# Altium schematic sheet lab2_lyahovskij_buck.SchDoc: =title_line_1 + title_line_2
size 594 x 420 mm; SheetNumber: n
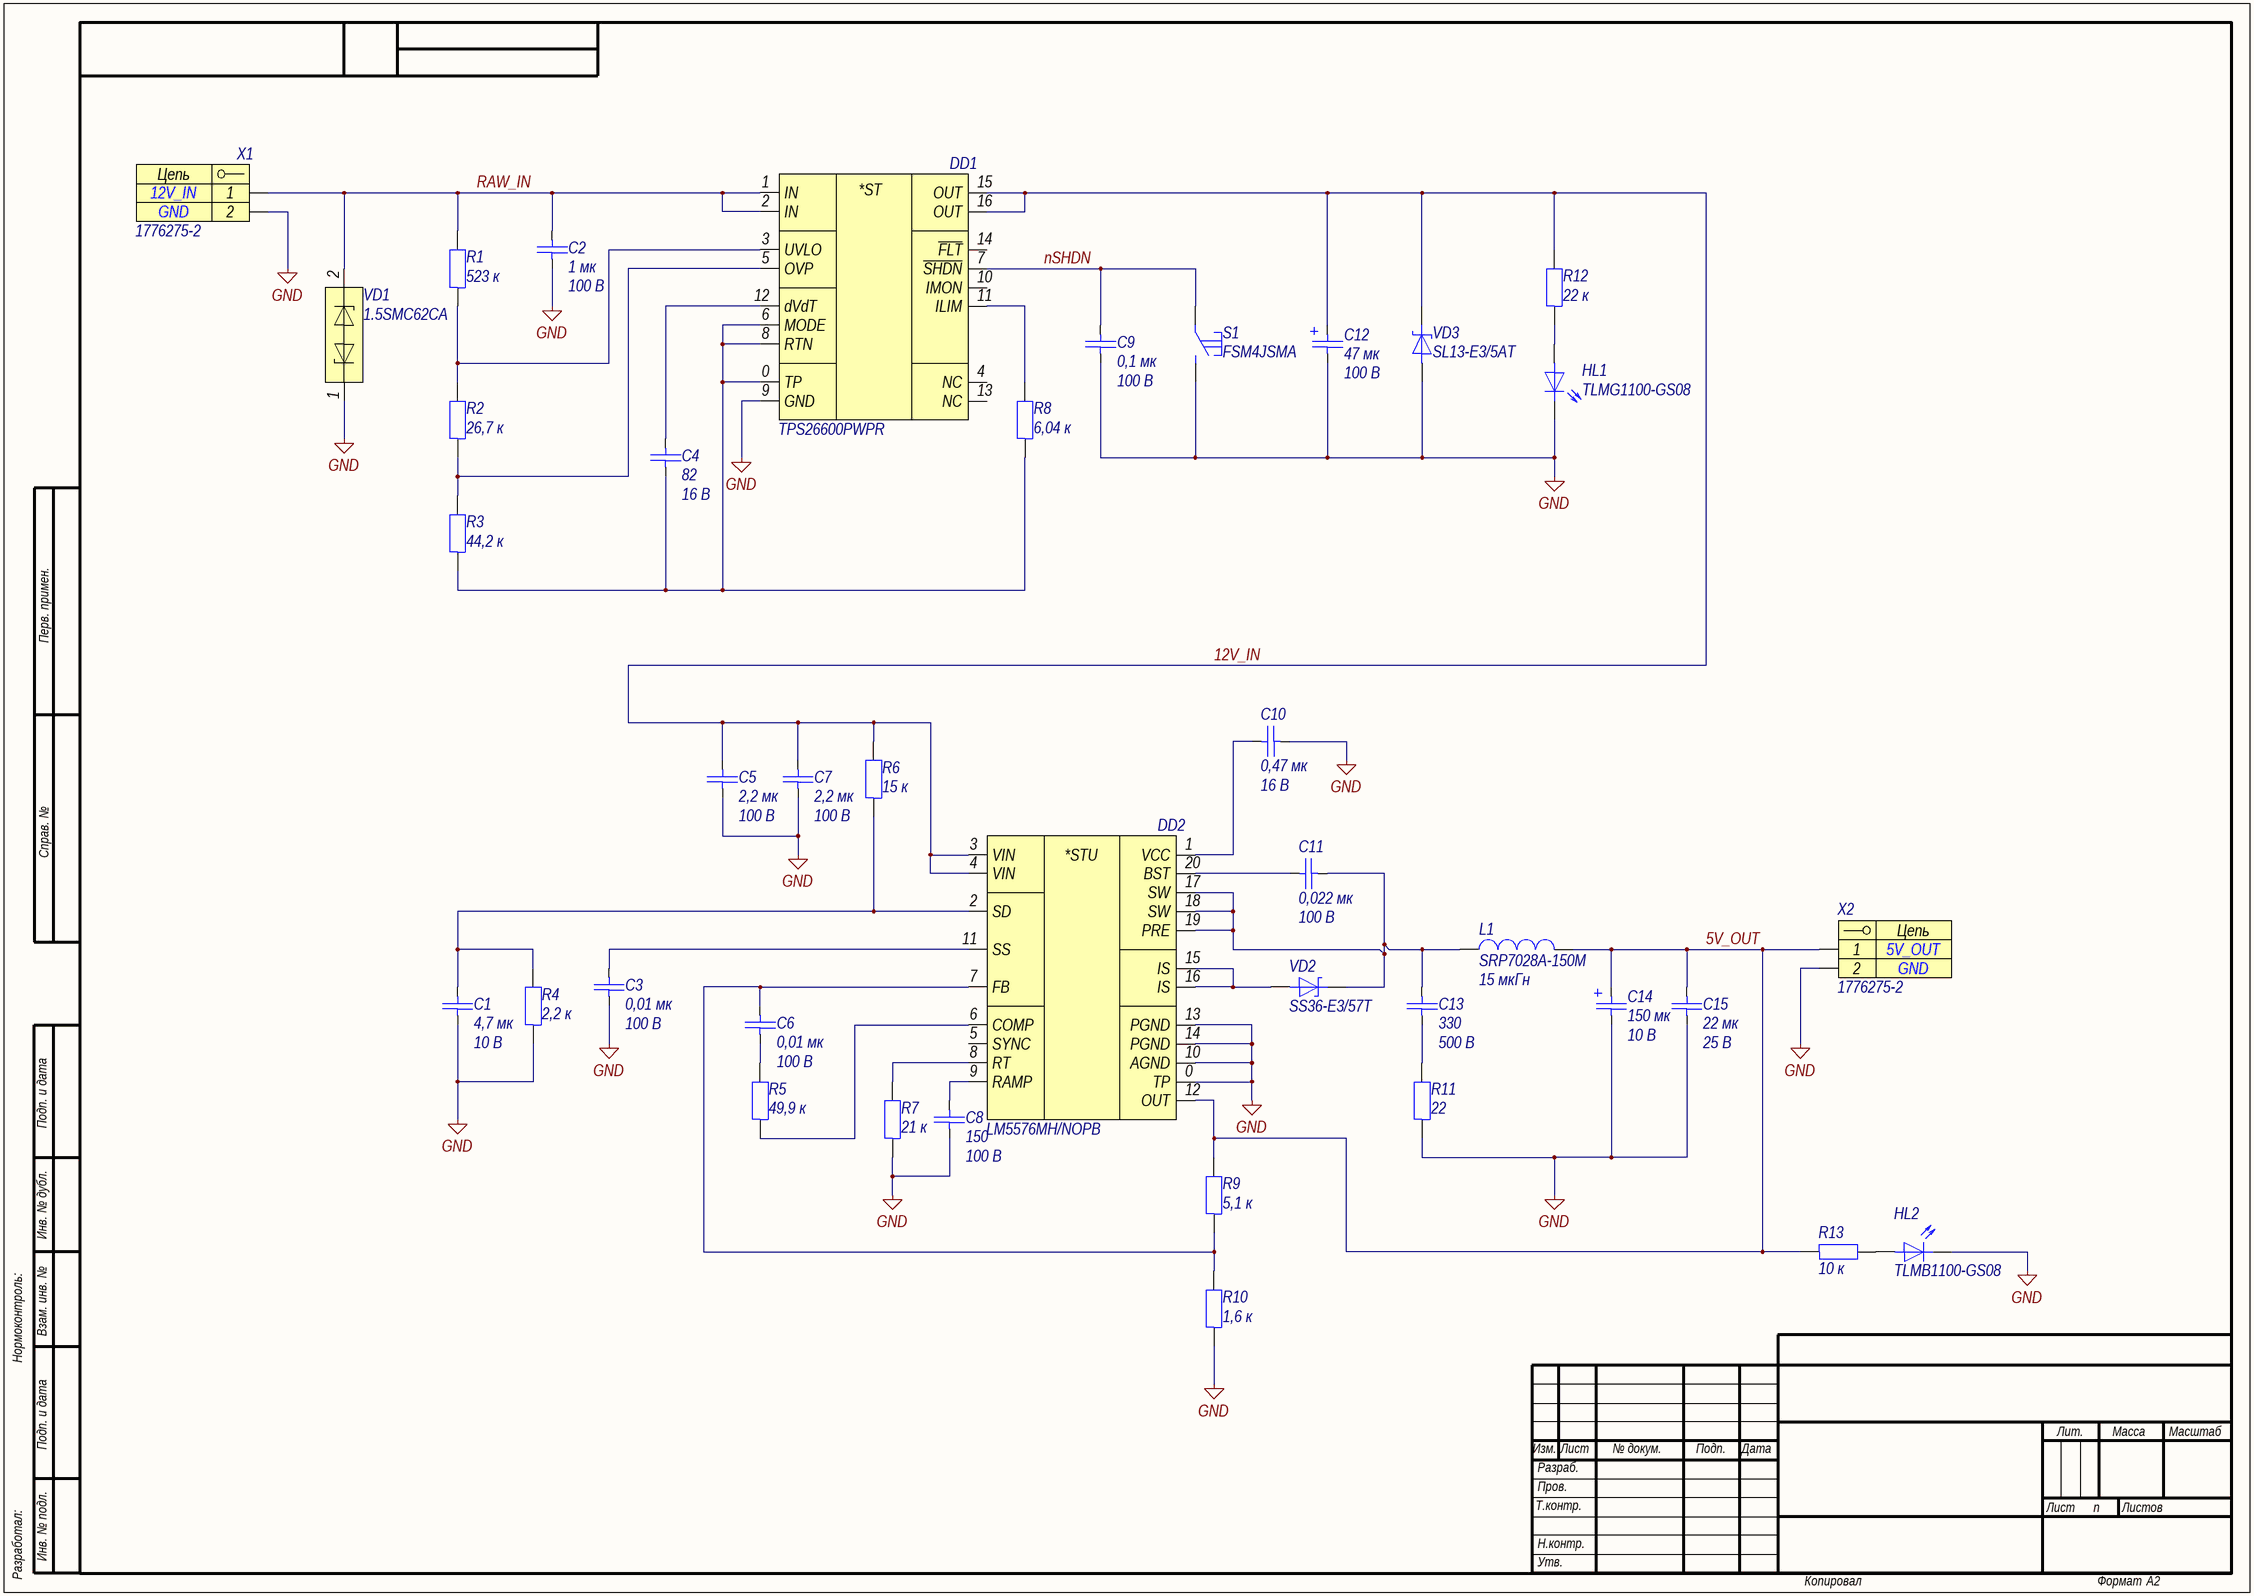
[diagram p0: lab2_lyahovskij_buck.SchDoc]

## Parts
C1  4,7 мк  Напряжение: 10 В  [C0603]
C2  1 мк  Напряжение: 100 В  [C1206]
C3  0,01 мк  Напряжение: 100 В  [C0603]
C4  82  Напряжение: 16 В  [C0603]
C5  2,2 мк  Напряжение: 100 В  [C1206]
C6  0,01 мк  Напряжение: 100 В  [C0603]
C7  2,2 мк  Напряжение: 100 В  [C1206]
C8  150  Напряжение: 100 В  [C0805]
C9  0,1 мк  Напряжение: 100 В  [C0603]
C10  0,47 мк  Напряжение: 16 В  [C0603]
C11  0,022 мк  Напряжение: 100 В  [C1210]
C12  47 мк  Напряжение: 100 В  [CAPAE-1000X1000X1200]
C13  330  Напряжение: 500 В  [C1210]
C14  150 мк  Напряжение: 10 В  [CAPAE-660X660X580]
C15  22 мк  Напряжение: 25 В  [C1210]
DD1  TPS26600PWPR  [HTSSOP-16]
DD2  LM5576MH/NOPB  [HTSSOP-20]
HL1  TLMG1100-GS08  [HL0603]
HL2  TLMB1100-GS08  [HL0603]
L1  SRP7028A-150M  Индуктивность: 15 мкГн  [SRP-2-730X660X280]
R1  523 к  [R0603]
R2  26,7 к  [R0603]
R3  44,2 к  [R0603]
R4  2,2 к  [R0603]
R5  49,9 к  [R0603]
R6  15 к  [R0603]
R7  21 к  [R0603]
R8  6,04 к  [R0603]
R9  5,1 к  [R0603]
R10  1,6 к  [R0603]
R11  22  [R0603]
R12  22 к  [R0603]
R13  10 к  [R0603]
S1  FSM4JSMA  [FSM4JSMA]
VD1  1.5SMC62CA  [DO-214AB]
VD2  SS36-E3/57T  [DO-214AB]
VD3  SL13-E3/5AT  [DO-214AC]
X1  1776275-2  [1776275-2]
X2  1776275-2  [1776275-2]

## Nets
GND: C1.2 C2.2 C3.2 C5.2 C7.2 C8.2 C9.2 C10.2 C12.2 C14.2 C15.2 DD1.9(GND) DD2.0(TP) DD2.10(AGND) DD2.13(PGND) DD2.14(PGND) HL1.1 HL2.1 R4.1 R7.1 R10.1 R11.1 S1.2 VD1.1 VD3.2 X1.2 X2.2
5V_OUT: C14.1 C15.1 DD2.12(OUT) L1.2 R9.2 R13.1 X2.1
12V_IN: C5.1 C7.1 C12.1 DD1.15(OUT) DD1.16(OUT) DD2.3(VIN) DD2.4(VIN) R6.2 R12.2 VD3.1
nSHDN: C9.1 DD1.7(~{SHDN}) S1.1
RAW_IN: C2.1 DD1.1(IN) DD1.2(IN) R1.2 VD1.2 X1.1
NetC1_1: C1.1 DD2.2(SD) R4.2 R6.1
NetC3_1: C3.1 DD2.11(SS)
NetC4_1: C4.1 DD1.12(dVdT)
NetC4_2: C4.2 DD1.0(TP) DD1.6(MODE) DD1.8(RTN) R3.1 R8.1
NetC6_1: C6.1 DD2.7(FB) R9.1 R10.2
NetC6_2: C6.2 R5.2
NetC8_1: C8.1 DD2.9(RAMP)
NetC10_1: C10.1 DD2.1(VCC)
NetC11_1: C11.1 DD2.20(BST)
NetC11_2: C11.2 C13.1 DD2.17(SW) DD2.18(SW) DD2.19(PRE) L1.1 VD2.1
NetC13_2: C13.2 R11.2
NetDD1_3: DD1.3(UVLO) R1.1 R2.2
NetDD1_5: DD1.5(OVP) R2.1 R3.2
NetDD1_11: DD1.11(ILIM) R8.2
NetDD2_6: DD2.6(COMP) R5.1
NetDD2_8: DD2.8(RT) R7.2
NetDD2_15: DD2.15(IS) DD2.16(IS) VD2.2
NetHL1_2: HL1.2 R12.1
NetHL2_2: HL2.2 R13.2

Not connected (* = marked no-connect by the designer): DD1 4(NC) 10(IMON) 13(NC) 14(~{FLT}); DD2 5(SYNC)

## Notes on the sheet
- Перв. примен.
- Справ. №
- Подп. и дата
- Инв. № дубл.
- Нормоконтроль:
- Взам. инв. №
- Изм.
- Лист
- № докум.
- Подп.
- Дата
- Лит.
- Масса
- Масштаб
- Т.контр.
- Пров.
- Разраб.
- Листов
- Разработал:
- Инв. № подл.
- Н.контр.
- Утв.
- Копировал
- Формат
- А2
- (in symbol dd0001) *ST
- (in symbol dd0016) *STU
- (in symbol x0005) Цепь

## Library data of the parts
C1 = c0082: =Описание; ID: c0082; Фамилия: Паньков; Описание: Конденсатор чип 0603 4,7 мкФ 10 В ±10 %; Наименование: CC0603KRX7R6BB475; Производитель: YAGEO Corp.; Отклонение: ±10 %; Рабочие температуры: от –55 °С до +125 °С; Температурный коэффициент емкости: X7R; Корпус: 0603; Номинал: 4,7 мк; Номинальное напряжение: 10 В; HelpURL: https://www.yageo.com/upload/media/product/productsearch/datasheet/mlcc/UPY-GPHC_X7R_6.3V-to-50V_20.pdf
C2 = c0066: =Описание; ID: c0066; Фамилия: Ларионов; Описание: Конденсатор чип 1206 1 мкФ 100 В ±10 %; Наименование: CC1206KKX7R0BB105; Производитель: YAGEO Corp.; Отклонение: ±10 %; Рабочие температуры: от –55 °С до +125 °С; Температурный коэффициент емкости: X7R; Корпус: 1206; Номинал: 1 мк; Номинальное напряжение: 100 В; HelpURL: https://www.yageo.com/upload/media/product/productsearch/datasheet/mlcc/UPY-NP0X7R_MV_100-to-630V_22.pdf
C3 C6 = c0021: =Описание; ID: c0021; Фамилия: Ларионов; Описание: Конденсатор чип 0603 10 нФ 100 В ±5 %; Наименование: CC0603JRX7R0BB103; Производитель: YAGEO Corp.; Отклонение: ±5 %; Рабочие температуры: от –55 °С до +125 °С; Температурный коэффициент емкости: X7R; Корпус: 0603; Номинал: 0,01 мк; Номинальное напряжение: 100 В; HelpURL: https://www.yageo.com/upload/media/product/productsearch/datasheet/mlcc/UPY-NP0X7R_MV_100-to-630V_22.pdf
C4 = c0011: =Описание; ID: c0011; Фамилия: Ларионов; Описание: Конденсатор чип 0603 82 пФ 16 В ±5 %; Наименование: CC0603JRNPO7BN820; Производитель: YAGEO Corp.; Отклонение: ±5 %; Рабочие температуры: от –55 °С до +125 °С; Температурный коэффициент емкости: C0G; Корпус: 0603; Номинал: 82; Номинальное напряжение: 16 В; HelpURL: https://www.yageo.com/upload/media/product/productsearch/datasheet/mlcc/UPY-GP_NP0_16V-to-50V_18.pdf
C5 C7 = c0076: =Описание; ID: c0076; Фамилия: Ларионов; Описание: Конденсатор чип 1206 2,2 мкФ 100 В ±10 %; Наименование: CC1206KKX7R0BB225; Производитель: YAGEO Corp.; Отклонение: ±10 %; Рабочие температуры: от –55 °С до +125 °С; Температурный коэффициент емкости: X7R; Корпус: 1206; Номинал: 2,2 мк; Номинальное напряжение: 100 В; HelpURL: https://www.yageo.com/upload/media/product/productsearch/datasheet/mlcc/UPY-NP0X7R_MV_100-to-630V_22.pdf
C8 = c0121: =Описание; ID: c0121; Фамилия: Ляховский; Описание: Конденсатор чип 0805 150 пФ 100 В ±2 %; Наименование: C0805C151G1GACTU; Производитель: KEMET Corporation; Отклонение: ±2 %; Рабочие температуры: от –55 °С до +125 °С; Температурный коэффициент емкости: C0G; Корпус: 0805; Номинал: 150; Номинальное напряжение: 100 В; HelpURL: https://www.kemet.com/en/us/capacitors/ceramic/product/C0805C151G1GACTU.html
C9 = c0036: =Описание; ID: c0036; Фамилия: Ларионов; Описание: Конденсатор чип 0603 100 нФ 100 В ±10 %; Наименование: CC0603KRX7R0BB104; Производитель: YAGEO Corp.; Отклонение: ±10 %; Рабочие температуры: от –55 °С до +125 °С; Температурный коэффициент емкости: X7R; Корпус: 0603; Номинал: 0,1 мк; Номинальное напряжение: 100 В; HelpURL: https://www.yageo.com/upload/media/product/productsearch/datasheet/mlcc/UPY-NP0X7R_MV_100-to-630V_22.pdf
C10 = c0054: =Описание; ID: c0054; Фамилия: Паньков; Описание: Конденсатор чип 0603 470 нФ 16 В ±10 %; Наименование: CC0603KRX7R7BB474; Производитель: YAGEO Corp.; Отклонение: ±10 %; Рабочие температуры: от –55 °С до +125 °С; Температурный коэффициент емкости: X7R; Корпус: 0603; Номинал: 0,47 мк; Номинальное напряжение: 16 В; HelpURL: https://www.yageo.com/upload/media/product/products/datasheet/mlcc/UPY-GPHC_X7R_6.3V-to-50V_20.pdf
C11 = c0119: =Описание; ID: c0119; Фамилия: Ляховский; Описание: Конденсатор чип 1210 0,022 мкФ 100 В ±10 %; Наименование: CC1210KKX7R0BB223; Производитель: YAGEO Corp.; Отклонение: ±10 %; Рабочие температуры: от –55 °С до +125 °С; Температурный коэффициент емкости: X7R; Корпус: 1210; Номинал: 0,022 мк; Номинальное напряжение: 100 В; HelpURL: https://www.yageo.com/upload/media/product/productsearch/datasheet/mlcc/UPY-NP0X7R_MV_100-to-630V_22.pdf
C12 = c0118: =Описание; ID: c0118; Фамилия: Ларионов; Описание: Конденсатор электролитический 47 мкФ 100 В ±20 %; Наименование: MAL214699904E3; Производитель: Vishay Intertechnology, Inc.; Отклонение: ±20 %; Рабочие температуры: от –55 °С до +125 °С; Корпус: CAPAE (10 x 10 x 12); Номинал: 47 мк; Номинальное напряжение: 100 В; Температурный коэффициент емкости: -; HelpURL: https://www.vishay.com/capacitors/list/product-28403/
C13 = c0012: =Описание; ID: c0012; Фамилия: Ляховский; Описание: Конденсатор чип 1210 330 пФ 500 В ±10 %; Наименование: CC1210JKNPOBBN331; Производитель: YAGEO Corp.; Отклонение: ±5 %; Рабочие температуры: от –55 °С до +125 °С; Температурный коэффициент емкости: C0G; Корпус: 1210; Номинал: 330; Номинальное напряжение: 500 В; HelpURL: https://www.yageo.com/upload/media/product/productsearch/datasheet/mlcc/UPY-NP0X7R_MV_100-to-630V_22.pdf
C14 = c0120: =Описание; ID: c0120; Фамилия: Водорезов; Описание: Конденсатор электролитический 150 мкФ 10 В ±20 %; Наименование: EEEFK1A151AL; Производитель: Panasonic Corporation; Отклонение: ±20 %; Рабочие температуры: от –55 °С до +105 °С; Корпус: CAPAE (6,6 x 6,6 x 5,8); Номинал: 150 мк; Номинальное напряжение: 10 В; Температурный коэффициент емкости: -; HelpURL: https://industrial.panasonic.com/ww/products/capacitors/aluminum-capacitors/aluminum-cap-smd/models/EEEFK1A151AL
C15 = c0113: =Описание; ID: c0113; Фамилия: Ляпцев; Описание: Конденсатор чип 1210 22 мкФ 25 В ±10 %; Наименование: GRM32ER61E226KE15L; Производитель: Murata Manufacturing Co., Ltd.; Отклонение: ±10 %; Рабочие температуры: от –55 °С до +85 °С; Температурный коэффициент емкости: X5R; Корпус: 1210; Номинал: 22 мк; Номинальное напряжение: 25 В; HelpURL: https://www.murata.com/en-us/products/productdetail?partno=GRM32ER61E226KE15%23
DD1 = dd0001: =Описание; ID: dd0001; Фамилия: Ларионов; Описание: Защитная микросхема eFuse 60 В и 2 А; Производитель: Texas Instruments; Напряжение: от 4,2 В до 60 В; Максимальное напряжение: 62 В; Ток: от 0,1 А до 2,23 А; Рабочие температуры: от -40 °С до +125 °С; Наименование: TPS26600PWPR; Корпус: HTSSOP-16; HelpURL: https://www.ti.com/product/TPS2660
DD2 = dd0016: =Описание; ID: dd0016; Фамилия: Ляховский; Описание: Понижающий преобразователь напряжения 75 В и 3 А; Производитель: Texas Instruments; Входное напряжение: от 6 В до 75 В; Выходное напряжение: от 1,23 В до 70 В; Коммутируемый ток: до 3 А; Частота переключения: от 50 кГц до 500 кГц; Рабочие температуры: от –40 °С до +125 °С; Наименование: LM5576MH/NOPB; Корпус: HTSSOP-20; HelpURL: https://www.ti.com/product/LM5576
HL1 = hl0005: =Описание; ID: hl0005; Фамилия: Ларионов; Описание: Светодиод чип 0603 зеленый; Производитель: Vishay Intertechnology, Inc.; Цвет: Green; Номинальная сила света: 35 мкд; Номинальная длина волны: 570 нм; Номинальный прямой ток: 30 мА; Номинальное падение напряжения: 2,1 В; Рассеиваемая мощность: 90 мВт; Рабочие температуры: от –40 °С до +100 °С; Корпус: 0603; Наименование: TLMG1100-GS08; HelpURL: https://www.vishay.com/leds/list/product-83173/
HL2 = hl0006: =Описание; ID: hl0006; Фамилия: Ларионов; Описание: Светодиод чип 0603 синий; Производитель: Vishay Intertechnology, Inc.; Цвет: Blue; Номинальная сила света: 5 мкд; Номинальная длина волны: 466 нм; Номинальный прямой ток: 30 мА; Номинальное падение напряжения: 3,9 В; Рассеиваемая мощность: 90 мВт; Рабочие температуры: от –40 °С до +100 °С; Корпус: 0603; Примечание: Not for new design; Наименование: TLMB1100-GS08; HelpURL: https://www.vishay.com/leds/list/product-83173/
L1 = l0009: =Описание; ID: l0009; Фамилия: Ляховский; Описание: Катушка индуктивности 15 мкГн ±20 %; Производитель: Bourns, Inc.; Отклонение: ±20 %; Номинальное активное сопротивление: 107 мОм; Максимальное активное сопротивление: 123 мОм; Резонансная частота: 12 МГц; Номинальный ток (при нагреве на 20 °С/40 °С): 3 А; Ток насыщения: 4 А; Рабочее напряжение: не указано; Рабочие температуры: от –55 °С до +150 °С; Корпус: 7,3 x 6,6 x 2,8; Наименование: SRP7028A-150M; Номинал: 15 мкГн; HelpURL: https://www.bourns.com/products/magnetic-products/power-inductors-aec-q200-compliant/product/SRP7028A
R1 = r0119: =Описание; ID: r0119; Фамилия: Жернаков; Описание: Резистор чип 0603 523 кОм ±1 % 0,1 Вт; Наименование: RC0603FR-07523KL; Производитель: YAGEO Corp.; Отклонение: ±1 %; Номинальное напряжение: 75 В; Рабочие температуры: от –55 °С до +155 °С; Номинальный ток: 1 А; Корпус: 0603; Номинал: 523 к; HelpURL: https://www.yageo.com/upload/media/product/productsearch/datasheet/rchip/PYu-RC_Group_51_RoHS_L_11.pdf
R2 = r0073: =Описание; ID: r0073; Фамилия: Ларионов; Описание: Резистор чип 0603 26,7 кОм ±1 % 0,1 Вт; Наименование: RC0603FR-0726K7L; Производитель: YAGEO Corp.; Отклонение: ±1 %; Номинальное напряжение: 75 В; Рабочие температуры: от –55 °С до +155 °С; Номинальный ток: 1 А; Корпус: 0603; Номинал: 26,7 к; HelpURL: https://www.yageo.com/upload/media/product/productsearch/datasheet/rchip/PYu-RC_Group_51_RoHS_L_11.pdf
R3 = r0082: =Описание; ID: r0082; Фамилия: Ларионов; Описание: Резистор чип 0603 44,2 кОм ±1 % 0,1 Вт; Наименование: RC0603FR-0744K2L; Производитель: YAGEO Corp.; Отклонение: ±1 %; Номинальное напряжение: 75 В; Рабочие температуры: от –55 °С до +155 °С; Номинальный ток: 1 А; Корпус: 0603; Номинал: 44,2 к; HelpURL: https://www.yageo.com/upload/media/product/productsearch/datasheet/rchip/PYu-RC_Group_51_RoHS_L_11.pdf
R4 = r0040: =Описание; ID: r0040; Фамилия: Паньков; Описание: Резистор чип 0603 2,2 кОм ±1 % 0,1 Вт; Наименование: RC0603FR-072K2L; Производитель: YAGEO Corp.; Отклонение: ±1 %; Номинальное напряжение: 75 В; Рабочие температуры: от –55 °С до +155 °С; Номинальный ток: 1 А; Корпус: 0603; Примечание: Ряд E24; Номинал: 2,2 к; HelpURL: https://www.yageo.com/upload/media/product/productsearch/datasheet/rchip/PYu-RC_Group_51_RoHS_L_11.pdf
R5 = r0129: =Описание; ID: r0129; Фамилия: Ляховский; Описание: Резистор чип 0603 49,9 кОм ±1 % 0,1 Вт; Наименование: RC0603FR-0749K9L; Производитель: YAGEO Corp.; Отклонение: ±1 %; Номинальное напряжение: 75 В; Рабочие температуры: от –55 °С до +155 °С; Номинальный ток: 1 А; Корпус: 0603; Номинал: 49,9 к; HelpURL: https://www.yageo.com/upload/media/product/productsearch/datasheet/rchip/PYu-RC_Group_51_RoHS_L_11.pdf
R6 = r0066: =Описание; ID: r0066; Фамилия: Паньков; Описание: Резистор чип 0603 15 кОм ±1 % 0,1 Вт; Наименование: RC0603FR-0715KL; Производитель: YAGEO Corp.; Отклонение: ±1 %; Номинальное напряжение: 75 В; Рабочие температуры: от –55 °С до +155 °С; Номинальный ток: 1 А; Корпус: 0603; Примечание: Ряд E24; Номинал: 15 к; HelpURL: https://www.yageo.com/upload/media/product/productsearch/datasheet/rchip/PYu-RC_Group_51_RoHS_L_11.pdf
R7 = r0130: =Описание; ID: r0130; Фамилия: Ляховский; Описание: Резистор чип 0603 21 кОм ±1 % 0,1 Вт; Наименование: RC0603FR-0721KL; Производитель: YAGEO Corp.; Отклонение: ±1 %; Номинальное напряжение: 75 В; Рабочие температуры: от –55 °С до +155 °С; Номинальный ток: 1 А; Корпус: 0603; Примечание: Ряд E24; Номинал: 21 к; HelpURL: https://www.yageo.com/upload/media/product/productsearch/datasheet/rchip/PYu-RC_Group_51_RoHS_L_11.pdf
R8 = r0053: =Описание; ID: r0053; Фамилия: Ларионов; Описание: Резистор чип 0603 6,04 кОм ±1 % 0,1 Вт; Наименование: RC0603FR-076K04L; Производитель: YAGEO Corp.; Отклонение: ±1 %; Номинальное напряжение: 75 В; Рабочие температуры: от –55 °С до +155 °С; Номинальный ток: 1 А; Корпус: 0603; Номинал: 6,04 к; HelpURL: https://www.yageo.com/upload/media/product/productsearch/datasheet/rchip/PYu-RC_Group_51_RoHS_L_11.pdf
R9 = r0051: =Описание; ID: r0051; Фамилия: Жернаков; Описание: Резистор чип 0603 5,1 кОм ±1 % 0,1 Вт; Наименование: RC0603FR-075K1L; Производитель: YAGEO Corp.; Отклонение: ±1 %; Номинальное напряжение: 75 В; Рабочие температуры: от –55 °С до +155 °С; Номинальный ток: 1 А; Корпус: 0603; Примечание: Ряд E24; Номинал: 5,1 к; HelpURL: https://www.yageo.com/upload/media/product/productsearch/datasheet/rchip/PYu-RC_Group_51_RoHS_L_11.pdf
R10 = r0037: =Описание; ID: r0037; Фамилия: Паньков; Описание: Резистор чип 0603 1,6 кОм ±1 % 0,1 Вт; Наименование: RC0603FR-071K6L; Производитель: YAGEO Corp.; Отклонение: ±1 %; Номинальное напряжение: 75 В; Рабочие температуры: от –55 °С до +155 °С; Номинальный ток: 1 А; Корпус: 0603; Примечание: Ряд E24; Номинал: 1,6 к; HelpURL: https://www.yageo.com/upload/media/product/productsearch/datasheet/rchip/PYu-RC_Group_51_RoHS_L_11.pdf
R11 = r0004: =Описание; ID: r0004; Фамилия: Ларионов; Описание: Резистор чип 0603 22 Ом ±1 % 0,1 Вт; Наименование: RC0603FR-0722RL; Производитель: YAGEO Corp.; Отклонение: ±1 %; Номинальное напряжение: 75 В; Рабочие температуры: от –55 °С до +155 °С; Номинальный ток: 1 А; Корпус: 0603; Примечание: Ряд E24; Номинал: 22; HelpURL: https://www.yageo.com/upload/media/product/productsearch/datasheet/rchip/PYu-RC_Group_51_RoHS_L_11.pdf
R12 = r0071: =Описание; ID: r0071; Фамилия: Паньков; Описание: Резистор чип 0603 22 кОм ±1 % 0,1 Вт; Наименование: RC0603FR-0722KL; Производитель: YAGEO Corp.; Отклонение: ±1 %; Номинальное напряжение: 75 В; Рабочие температуры: от –55 °С до +155 °С; Номинальный ток: 1 А; Корпус: 0603; Примечание: Ряд E24; Номинал: 22 к; HelpURL: https://www.yageo.com/upload/media/product/productsearch/datasheet/rchip/PYu-RC_Group_51_RoHS_L_11.pdf
R13 = r0060: =Описание; ID: r0060; Фамилия: Самарин; Описание: Резистор чип 0603 10 кОм ±1 % 0,1 Вт; Наименование: RC0603FR-0710KL; Производитель: YAGEO Corp.; Отклонение: ±1 %; Номинальное напряжение: 75 В; Рабочие температуры: от –55 °С до +155 °С; Номинальный ток: 1 А; Корпус: 0603; Примечание: Ряд E24; Номинал: 10 к; HelpURL: https://www.yageo.com/upload/media/product/productsearch/datasheet/rchip/PYu-RC_Group_51_RoHS_L_11.pdf
S1 = s0001: =Описание; ID: s0001; Фамилия: Паньков; Описание: Тактовая кнопка поверхностного монтажа; Производитель: TE Connectivity; Ток нагрузки: 50 мА @ 24 В; Сопротивление контакта: 100 мОм; Количество контактов: 4; Рабочие температуры: от –35 °С до +85 °С; Промывка: Разрешена; Корпус: 6,00x6,00x4,98; Наименование: FSM4JSMA; HelpURL: https://www.te.com/usa-en/product-4-1437565-1.html
VD1 = vd0006: =Описание; ID: vd0006; Фамилия: Ларионов; Описание: Двунаправленная диодная сборка для подавления помех, 53 В; Производитель: Littelfuse, Inc.; Наименование: 1.5SMC62CA; Корпус: DO-214AB; HelpURL: https://www.littelfuse.com/products/tvs-diodes/surface-mount/1_5smc.aspx
VD2 = vd0004: =Описание; ID: vd0004; Фамилия: Жернаков; Описание: Диод Шоттки 60 В 3 А; Производитель: Vishay Intertechnology, Inc.; Пиковое прямое напряжение: 0,75 В; Импульсное обратное напряжение: 60 В; Макс допустимый средний прямой ток: 3 А; Рабочие температуры: от –55 °С до +150 °С; Наименование: SS36-E3/57T; Корпус: DO-214AB; HelpURL: https://www.vishay.com/product?docid=88751
VD3 = vd0002: =Описание; ID: vd0002; Фамилия: Ларионов; Описание: Диод Шоттки 30 В 1,5 А; Производитель: Vishay Intertechnology, Inc.; Пиковое прямое напряжение: 0,445 В; Импульсное обратное напряжение: 30 В; Макс допустимый средний прямой ток: 1,5 А; Рабочие температуры: от –55 °С до +125 °С; Наименование: SL13-E3/5AT; Корпус: DO-214AC; HelpURL: https://www.vishay.com/product?docid=88740
X1 = x0005: =Описание; Contact_1: 12V_IN; Contact_2: GND; ID: x0005; Фамилия: Паньков; Описание: Клеммная колодка 2 pin 3,5 мм; Производитель: TE Connectivity; Наименование: 1776275-2; HelpURL: https://www.te.com/usa-en/product-1776275-2.html
X2 = x0005: =Описание; Contact_1: 5V_OUT; Contact_2: GND; ID: x0005; Фамилия: Паньков; Описание: Клеммная колодка 2 pin 3,5 мм; Производитель: TE Connectivity; Наименование: 1776275-2; HelpURL: https://www.te.com/usa-en/product-1776275-2.html